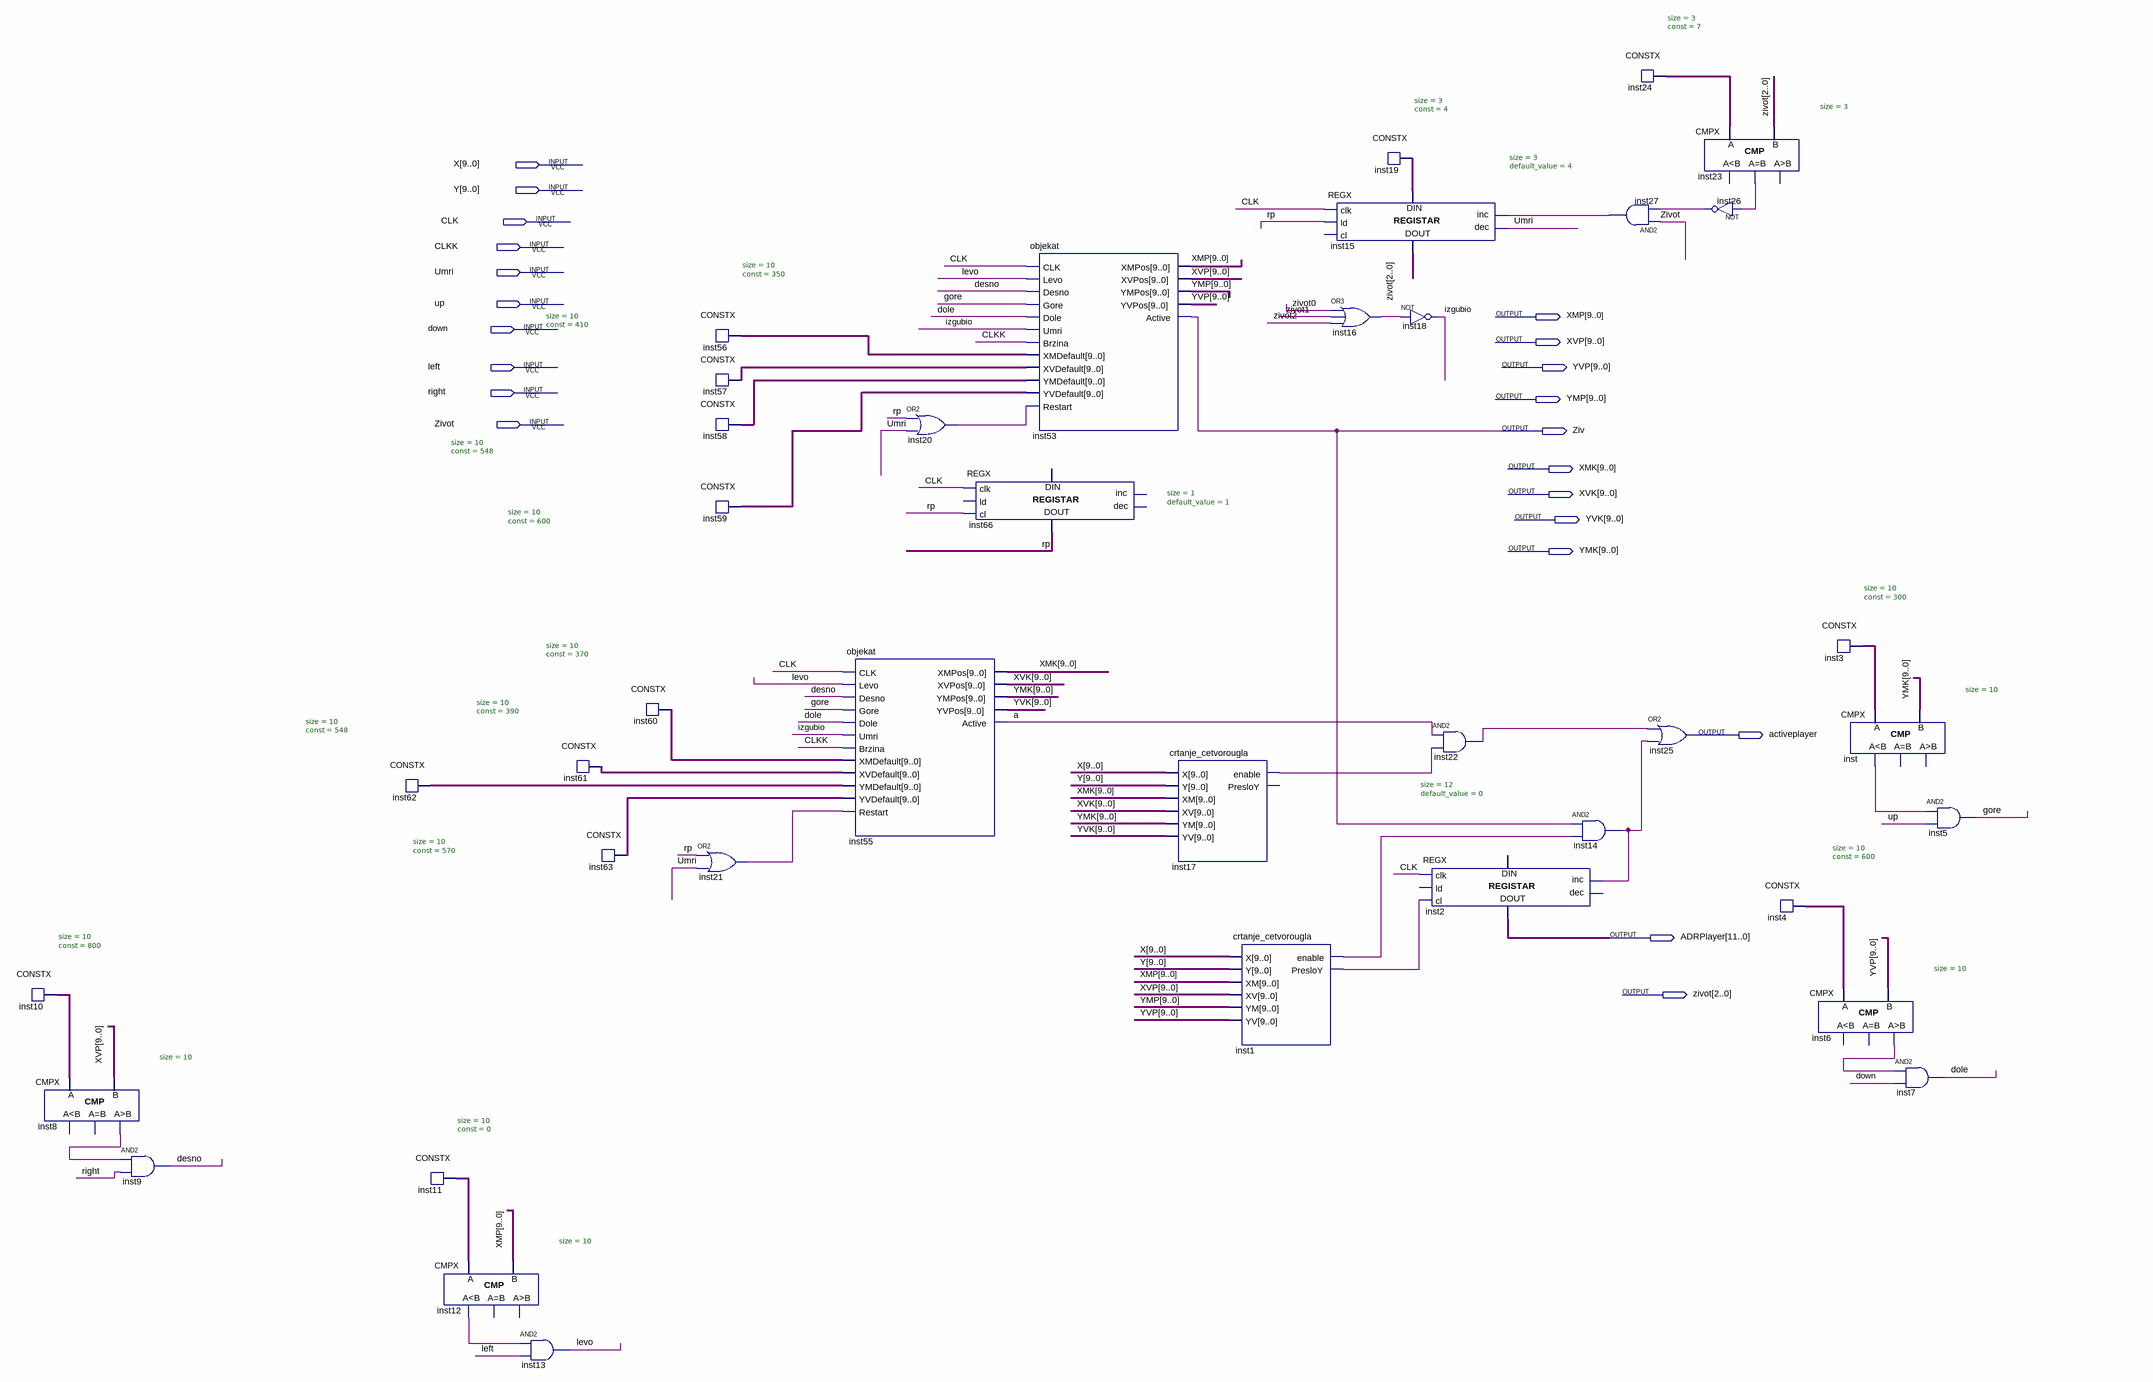
[diagram p0: schematic sheet]
// Quartus schematic Player.bdf as structural Verilog: 39 symbols, 22 pins
module Player (
  input  [9:0] X,
  input  [9:0] Y,
  input  CLK,
  input  CLKK,
  input  Umri,
  input  up,
  input  down,
  input  left,
  input  right,
  input  Zivot_1bit,
  output [9:0] XMP,
  output [9:0] XVP,
  output [9:0] YVP,
  output [9:0] YMP,
  output Ziv,
  output [9:0] XMK,
  output [9:0] XVK,
  output [9:0] YVK,
  output [9:0] YMK,
  output activeplayer,
  output [11:0] ADRPlayer,
  output [2:0] Zivot
);

  wire a, desno, dole, gore, inst1_enable, inst1_presloy, inst6_gr, inst8_gr, inst12_ls, inst14_out,
       inst16_out, inst17_enable, inst20_out, inst21_out, inst22_out, inst23_eq, inst26_out, inst27_out,
       inst_ls, izgubio, levo, rp;
  wire [2:0] inst19_data, inst24_data;
  wire [9:0] inst3_data, inst4_data, inst10_data, inst11_data, inst56_data, inst57_data, inst58_data,
       inst59_data, inst60_data, inst61_data, inst62_data, inst63_data;

  CONSTX #(.size(10), .\const (800)) inst10 (.data(inst10_data));
  CMPX #(.size(10)) inst8 (.A(inst10_data), .B(XVP), .gr(inst8_gr));  // open: ls, eq
  and inst9 (desno, inst8_gr, right);
  CONSTX #(.size(10), .\const (548)) inst62 (.data(inst62_data));
  CONSTX #(.size(10), .\const (0)) inst11 (.data(inst11_data));
  CMPX #(.size(10)) inst12 (.A(inst11_data), .B(XMP), .ls(inst12_ls));  // open: eq, gr
  and inst13 (levo, inst12_ls, left);
  CONSTX #(.size(10), .\const (390)) inst61 (.data(inst61_data));
  CONSTX #(.size(10), .\const (570)) inst63 (.data(inst63_data));
  CONSTX #(.size(10), .\const (370)) inst60 (.data(inst60_data));
  CONSTX #(.size(10), .\const (350)) inst56 (.data(inst56_data));
  CONSTX #(.size(10), .\const (410)) inst57 (.data(inst57_data));
  CONSTX #(.size(10), .\const (548)) inst58 (.data(inst58_data));
  CONSTX #(.size(10), .\const (600)) inst59 (.data(inst59_data));
  or inst21 (inst21_out, rp, Umri);
  objekat inst55 (
    .CLK(CLK), .Levo(levo), .Desno(desno), .Gore(gore), .Dole(dole), .Umri(izgubio), .Brzina(CLKK),
    .XMDefault(inst60_data), .XVDefault(inst61_data), .YMDefault(inst62_data), .YVDefault(inst63_data),
    .Restart(inst21_out), .XMPos(XMK), .XVPos(XVK), .YMPos(YMK), .YVPos(YVK), .Active(a));
  or inst20 (inst20_out, rp, Umri);
  REGX #(.size(1), .default_value(1)) inst66 (.clk(CLK), .cl(rp), .data_out(rp));  // open: ld, inc, dec, data_in
  objekat inst53 (
    .CLK(CLK), .Levo(levo), .Desno(desno), .Gore(gore), .Dole(dole), .Umri(izgubio), .Brzina(CLKK),
    .XMDefault(inst56_data), .XVDefault(inst57_data), .YMDefault(inst58_data), .YVDefault(inst59_data),
    .Restart(inst20_out), .XMPos(XMP), .XVPos(XVP), .YMPos(YMP), .YVPos(YVP), .Active(Ziv));
  crtanje_cetvorougla inst17 (
    .X(X), .Y(Y), .XM(XMK), .XV(XVK), .YM(YMK), .YV(YVK), .enable(inst17_enable));  // open: PresloY
  crtanje_cetvorougla inst1 (
    .X(X), .Y(Y), .XM(XMP), .XV(XVP), .YM(YMP), .YV(YVP), .enable(inst1_enable), .PresloY(inst1_presloy));
  REGX #(.size(3), .default_value(4)) inst15 (
    .clk(CLK), .ld(rp), .inc(inst27_out), .dec(Umri), .data_in(inst19_data), .data_out(Zivot));  // open: cl
  or inst16 (inst16_out, Zivot[0], Zivot[1], Zivot[2]);
  CONSTX #(.size(3), .\const (4)) inst19 (.data(inst19_data));
  not inst18 (izgubio, inst16_out);
  and inst22 (inst22_out, a, inst17_enable);
  REGX #(.size(12), .default_value(0)) inst2 (
    .clk(CLK), .cl(inst1_presloy), .inc(inst14_out), .data_out(ADRPlayer));  // open: ld, dec, data_in
  and inst14 (inst14_out, Ziv, inst1_enable);
  CONSTX #(.size(3), .\const (7)) inst24 (.data(inst24_data));
  and inst27 (inst27_out, Zivot_1bit, inst26_out);
  or inst25 (activeplayer, inst22_out, inst14_out);
  CMPX #(.size(3)) inst23 (.A(inst24_data), .B(Zivot), .eq(inst23_eq));  // open: ls, gr
  not inst26 (inst26_out, inst23_eq);
  CONSTX #(.size(10), .\const (600)) inst4 (.data(inst4_data));
  CONSTX #(.size(10), .\const (300)) inst3 (.data(inst3_data));
  CMPX #(.size(10)) inst (.A(inst3_data), .B(YMK), .ls(inst_ls));  // open: eq, gr
  CMPX #(.size(10)) inst6 (.A(inst4_data), .B(YVP), .gr(inst6_gr));  // open: ls, eq
  and inst5 (gore, inst_ls, up);
  and inst7 (dole, inst6_gr, down);
endmodule
